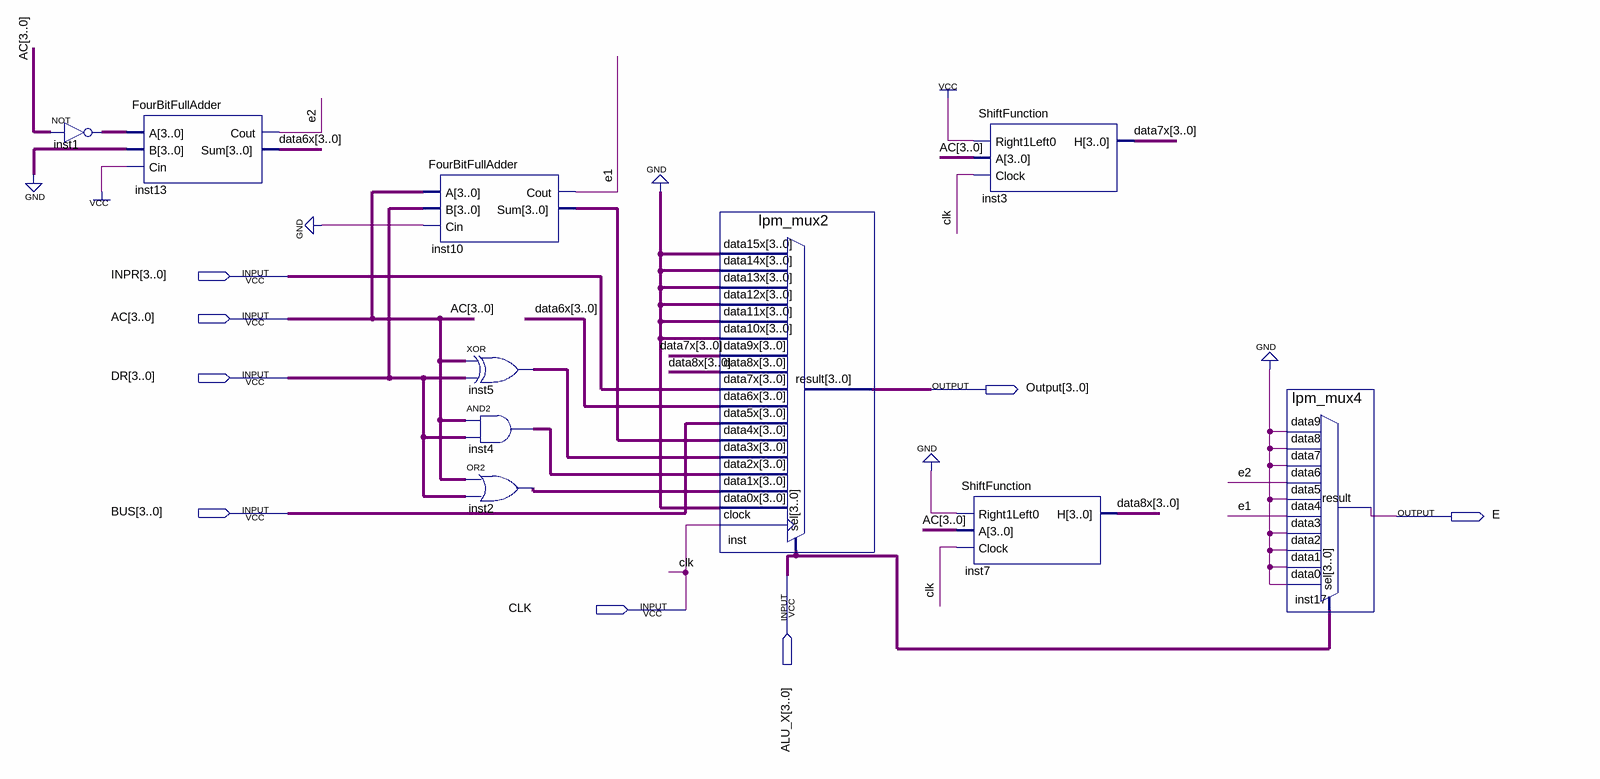
[diagram p0: schematic sheet]
// Quartus schematic ALU.bdf as structural Verilog: 10 symbols, 8 pins
module ALU (
  input  [3:0] INPR,
  input  [3:0] AC,
  input  [3:0] DR,
  input  [3:0] BUS,
  input  [3:0] ALU_X,
  input  CLK,
  output [3:0] Output,
  output E
);

  wire e1, e2;
  wire [3:0] data6x, data7x, data8x, inst1_out, inst2_out, inst4_out, inst5_out, inst10_sum;

  assign inst1_out = ~AC;  // NOT inst1, 4 bits wide
  FourBitFullAdder inst13 (.A(inst1_out), .B(4'b0000), .Cin(1'b1), .Cout(e2), .Sum(data6x));
  FourBitFullAdder inst10 (.A(AC), .B(DR), .Cin(1'b0), .Cout(e1), .Sum(inst10_sum));
  assign inst5_out = AC ^ DR;  // XOR inst5, 4 bits wide
  assign inst4_out = AC & DR;  // AND2 inst4, 4 bits wide
  assign inst2_out = AC | DR;  // OR2 inst2, 4 bits wide
  lpm_mux2 inst (
    .data15x(4'b0000), .data14x(4'b0000), .data13x(4'b0000), .data12x(4'b0000), .data11x(4'b0000),
    .data10x(4'b0000), .data9x(data7x), .data8x(data8x), .data7x(INPR), .data6x(data6x), .data5x(BUS),
    .data4x(inst10_sum), .data3x(inst5_out), .data2x(inst4_out), .data1x(inst2_out), .data0x(4'b0000),
    .clock(CLK), .sel(ALU_X), .result(Output));
  ShiftFunction inst3 (.Right1Left0(1'b1), .A(AC), .Clock(CLK), .H(data7x));
  ShiftFunction inst7 (.Right1Left0(1'b0), .A(AC), .Clock(CLK), .H(data8x));
  lpm_mux4 inst17 (
    .data9(1'b0), .data8(1'b0), .data7(1'b0), .data6(e2), .data5(1'b0), .data4(e1), .data3(1'b0),
    .data2(1'b0), .data1(1'b0), .data0(1'b0), .sel(ALU_X), .result(E));
endmodule
